# EAGLE design speaker_amp_single (EAGLE 6.3)

## Sheet 1 of 2
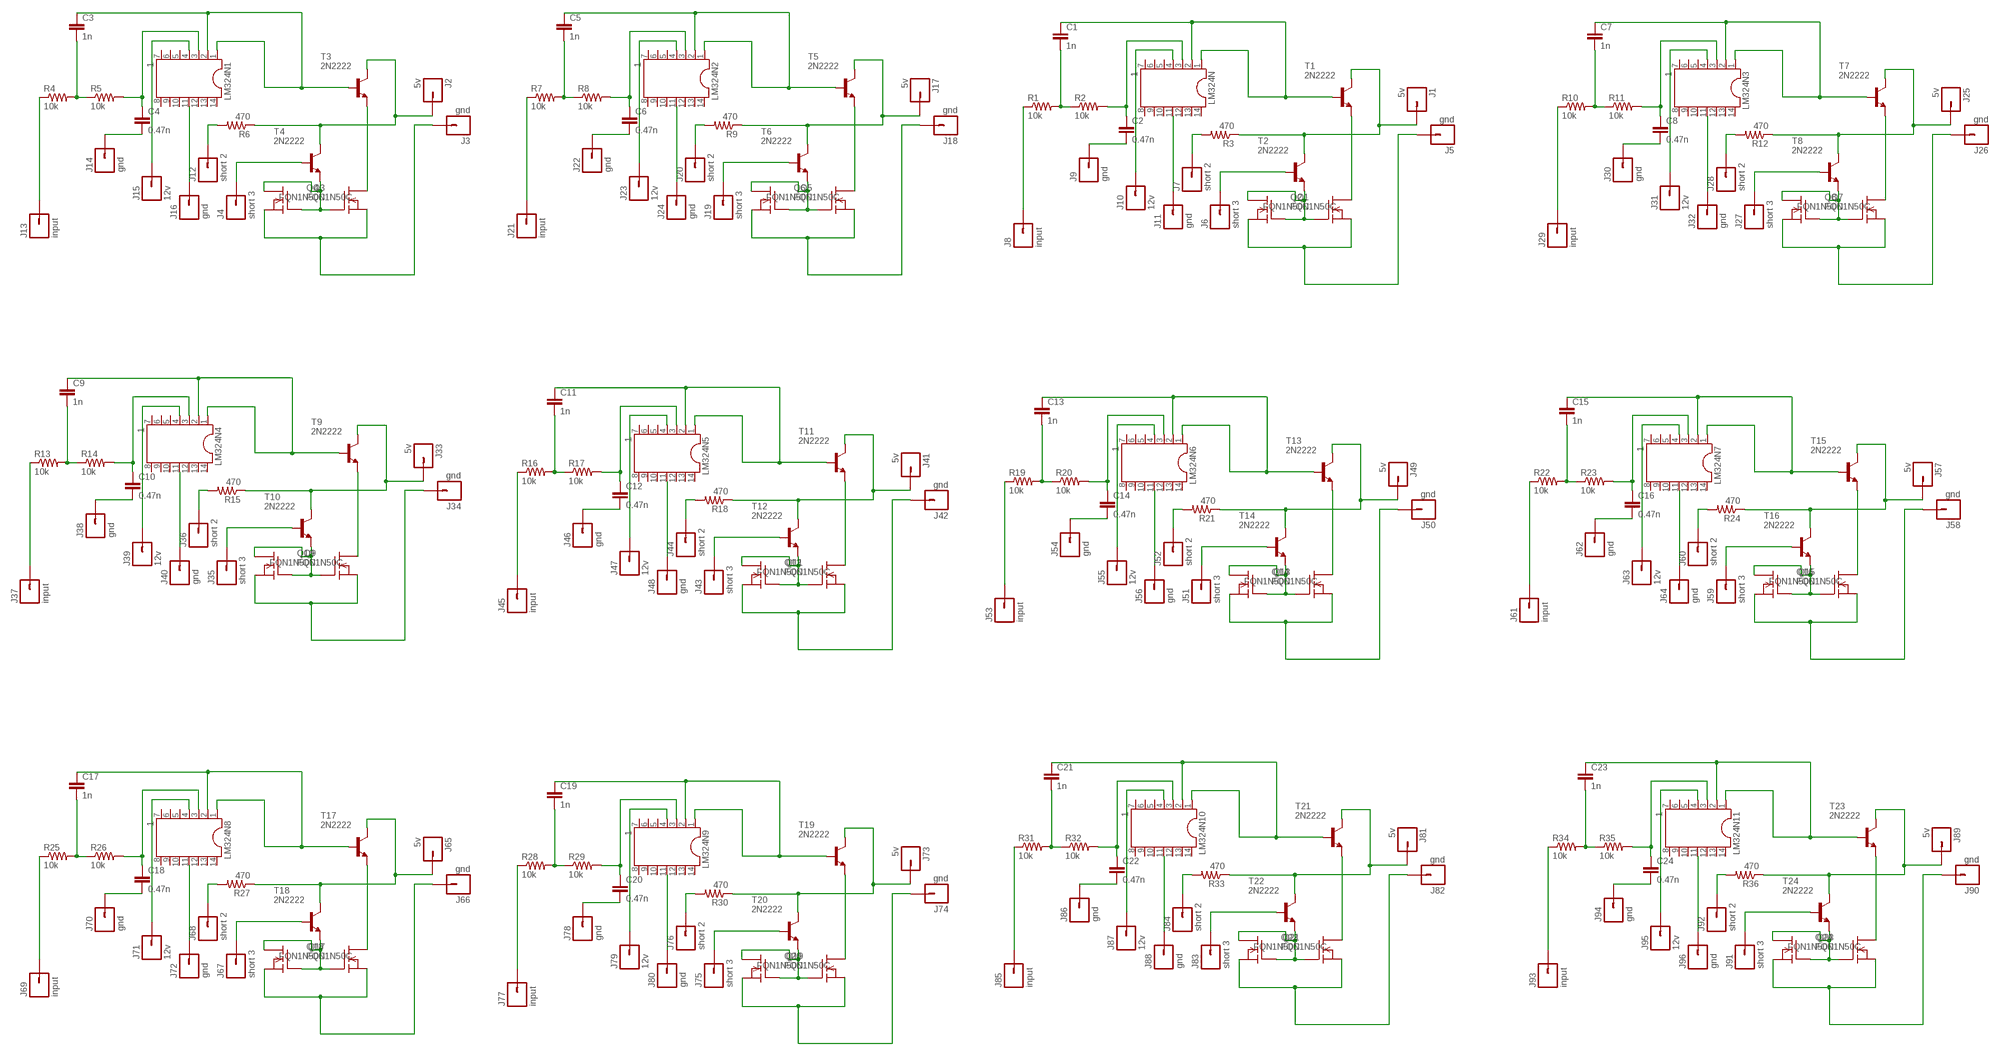
[diagram p0: schematic, sheet 1]

### Parts
C1  1n  CAPPTH  [CAP-PTH-SMALL]
C2  0.47n  CAPPTH  [CAP-PTH-SMALL]
C3  1n  CAPPTH  [CAP-PTH-SMALL]
C4  0.47n  CAPPTH  [CAP-PTH-SMALL]
C5  1n  CAPPTH  [CAP-PTH-SMALL]
C6  0.47n  CAPPTH  [CAP-PTH-SMALL]
C7  1n  CAPPTH  [CAP-PTH-SMALL]
C8  0.47n  CAPPTH  [CAP-PTH-SMALL]
C9  1n  CAPPTH  [CAP-PTH-SMALL]
C10  0.47n  CAPPTH  [CAP-PTH-SMALL]
C11  1n  CAPPTH  [CAP-PTH-SMALL]
C12  0.47n  CAPPTH  [CAP-PTH-SMALL]
C13  1n  CAPPTH  [CAP-PTH-SMALL]
C14  0.47n  CAPPTH  [CAP-PTH-SMALL]
C15  1n  CAPPTH  [CAP-PTH-SMALL]
C16  0.47n  CAPPTH  [CAP-PTH-SMALL]
C17  1n  CAPPTH  [CAP-PTH-SMALL]
C18  0.47n  CAPPTH  [CAP-PTH-SMALL]
C19  1n  CAPPTH  [CAP-PTH-SMALL]
C20  0.47n  CAPPTH  [CAP-PTH-SMALL]
C21  1n  CAPPTH  [CAP-PTH-SMALL]
C22  0.47n  CAPPTH  [CAP-PTH-SMALL]
C23  1n  CAPPTH  [CAP-PTH-SMALL]
C24  0.47n  CAPPTH  [CAP-PTH-SMALL]
J1  5v  M01PTH  [1X01]
J2  5v  M01PTH  [1X01]
J3  gnd  M01PTH  [1X01]
J4  short 3  M01PTH  [1X01]
J5  gnd  M01PTH  [1X01]
J6  short 3  M01PTH  [1X01]
J7  short 2  M01PTH  [1X01]
J8  input  M01PTH  [1X01]
J9  gnd  M01PTH  [1X01]
J10  12v  M01PTH  [1X01]
J11  gnd  M01PTH  [1X01]
J12  short 2  M01PTH  [1X01]
J13  input  M01PTH  [1X01]
J14  gnd  M01PTH  [1X01]
J15  12v  M01PTH  [1X01]
J16  gnd  M01PTH  [1X01]
J17  5v  M01PTH  [1X01]
J18  gnd  M01PTH  [1X01]
J19  short 3  M01PTH  [1X01]
J20  short 2  M01PTH  [1X01]
J21  input  M01PTH  [1X01]
J22  gnd  M01PTH  [1X01]
J23  12v  M01PTH  [1X01]
J24  gnd  M01PTH  [1X01]
J25  5v  M01PTH  [1X01]
J26  gnd  M01PTH  [1X01]
J27  short 3  M01PTH  [1X01]
J28  short 2  M01PTH  [1X01]
J29  input  M01PTH  [1X01]
J30  gnd  M01PTH  [1X01]
J31  12v  M01PTH  [1X01]
J32  gnd  M01PTH  [1X01]
J33  5v  M01PTH  [1X01]
J34  gnd  M01PTH  [1X01]
J35  short 3  M01PTH  [1X01]
J36  short 2  M01PTH  [1X01]
J37  input  M01PTH  [1X01]
J38  gnd  M01PTH  [1X01]
J39  12v  M01PTH  [1X01]
J40  gnd  M01PTH  [1X01]
J41  5v  M01PTH  [1X01]
J42  gnd  M01PTH  [1X01]
J43  short 3  M01PTH  [1X01]
J44  short 2  M01PTH  [1X01]
J45  input  M01PTH  [1X01]
J46  gnd  M01PTH  [1X01]
J47  12v  M01PTH  [1X01]
J48  gnd  M01PTH  [1X01]
J49  5v  M01PTH  [1X01]
J50  gnd  M01PTH  [1X01]
J51  short 3  M01PTH  [1X01]
J52  short 2  M01PTH  [1X01]
J53  input  M01PTH  [1X01]
J54  gnd  M01PTH  [1X01]
J55  12v  M01PTH  [1X01]
J56  gnd  M01PTH  [1X01]
J57  5v  M01PTH  [1X01]
J58  gnd  M01PTH  [1X01]
J59  short 3  M01PTH  [1X01]
J60  short 2  M01PTH  [1X01]
J61  input  M01PTH  [1X01]
J62  gnd  M01PTH  [1X01]
J63  12v  M01PTH  [1X01]
J64  gnd  M01PTH  [1X01]
J65  5v  M01PTH  [1X01]
J66  gnd  M01PTH  [1X01]
J67  short 3  M01PTH  [1X01]
J68  short 2  M01PTH  [1X01]
J69  input  M01PTH  [1X01]
J70  gnd  M01PTH  [1X01]
J71  12v  M01PTH  [1X01]
J72  gnd  M01PTH  [1X01]
J73  5v  M01PTH  [1X01]
J74  gnd  M01PTH  [1X01]
J75  short 3  M01PTH  [1X01]
J76  short 2  M01PTH  [1X01]
J77  input  M01PTH  [1X01]
J78  gnd  M01PTH  [1X01]
J79  12v  M01PTH  [1X01]
J80  gnd  M01PTH  [1X01]
J81  5v  M01PTH  [1X01]
J82  gnd  M01PTH  [1X01]
J83  short 3  M01PTH  [1X01]
J84  short 2  M01PTH  [1X01]
J85  input  M01PTH  [1X01]
J86  gnd  M01PTH  [1X01]
J87  12v  M01PTH  [1X01]
J88  gnd  M01PTH  [1X01]
J89  5v  M01PTH  [1X01]
J90  gnd  M01PTH  [1X01]
J91  short 3  M01PTH  [1X01]
J92  short 2  M01PTH  [1X01]
J93  input  M01PTH  [1X01]
J94  gnd  M01PTH  [1X01]
J95  12v  M01PTH  [1X01]
J96  gnd  M01PTH  [1X01]
LM324N  1  DIL14  [DIL14]
LM324N1  1  DIL14  [DIL14]
LM324N2  1  DIL14  [DIL14]
LM324N3  1  DIL14  [DIL14]
LM324N4  1  DIL14  [DIL14]
LM324N5  1  DIL14  [DIL14]
LM324N6  1  DIL14  [DIL14]
LM324N7  1  DIL14  [DIL14]
LM324N8  1  DIL14  [DIL14]
LM324N9  1  DIL14  [DIL14]
LM324N10  1  DIL14  [DIL14]
LM324N11  1  DIL14  [DIL14]
Q1  FQN1N50C  [TO92]
Q2  FQN1N50C  [TO92]
Q3  FQN1N50C  [TO92]
Q4  FQN1N50C  [TO92]
Q5  FQN1N50C  [TO92]
Q6  FQN1N50C  [TO92]
Q7  FQN1N50C  [TO92]
Q8  FQN1N50C  [TO92]
Q9  FQN1N50C  [TO92]
Q10  FQN1N50C  [TO92]
Q11  FQN1N50C  [TO92]
Q12  FQN1N50C  [TO92]
Q13  FQN1N50C  [TO92]
Q14  FQN1N50C  [TO92]
Q15  FQN1N50C  [TO92]
Q16  FQN1N50C  [TO92]
Q17  FQN1N50C  [TO92]
Q18  FQN1N50C  [TO92]
Q19  FQN1N50C  [TO92]
Q20  FQN1N50C  [TO92]
Q21  FQN1N50C  [TO92]
Q22  FQN1N50C  [TO92]
Q23  FQN1N50C  [TO92]
Q24  FQN1N50C  [TO92]
R1  10k  RESISTORAXIAL-0.3  [AXIAL-0.3]
R2  10k  RESISTORAXIAL-0.3  [AXIAL-0.3]
R3  470  RESISTORAXIAL-0.3  [AXIAL-0.3]
R4  10k  RESISTORAXIAL-0.3  [AXIAL-0.3]
R5  10k  RESISTORAXIAL-0.3  [AXIAL-0.3]
R6  470  RESISTORAXIAL-0.3  [AXIAL-0.3]
R7  10k  RESISTORAXIAL-0.3  [AXIAL-0.3]
R8  10k  RESISTORAXIAL-0.3  [AXIAL-0.3]
R9  470  RESISTORAXIAL-0.3  [AXIAL-0.3]
R10  10k  RESISTORAXIAL-0.3  [AXIAL-0.3]
R11  10k  RESISTORAXIAL-0.3  [AXIAL-0.3]
R12  470  RESISTORAXIAL-0.3  [AXIAL-0.3]
R13  10k  RESISTORAXIAL-0.3  [AXIAL-0.3]
R14  10k  RESISTORAXIAL-0.3  [AXIAL-0.3]
R15  470  RESISTORAXIAL-0.3  [AXIAL-0.3]
R16  10k  RESISTORAXIAL-0.3  [AXIAL-0.3]
R17  10k  RESISTORAXIAL-0.3  [AXIAL-0.3]
R18  470  RESISTORAXIAL-0.3  [AXIAL-0.3]
R19  10k  RESISTORAXIAL-0.3  [AXIAL-0.3]
R20  10k  RESISTORAXIAL-0.3  [AXIAL-0.3]
R21  470  RESISTORAXIAL-0.3  [AXIAL-0.3]
R22  10k  RESISTORAXIAL-0.3  [AXIAL-0.3]
R23  10k  RESISTORAXIAL-0.3  [AXIAL-0.3]
R24  470  RESISTORAXIAL-0.3  [AXIAL-0.3]
R25  10k  RESISTORAXIAL-0.3  [AXIAL-0.3]
R26  10k  RESISTORAXIAL-0.3  [AXIAL-0.3]
R27  470  RESISTORAXIAL-0.3  [AXIAL-0.3]
R28  10k  RESISTORAXIAL-0.3  [AXIAL-0.3]
R29  10k  RESISTORAXIAL-0.3  [AXIAL-0.3]
R30  470  RESISTORAXIAL-0.3  [AXIAL-0.3]
R31  10k  RESISTORAXIAL-0.3  [AXIAL-0.3]
R32  10k  RESISTORAXIAL-0.3  [AXIAL-0.3]
R33  470  RESISTORAXIAL-0.3  [AXIAL-0.3]
R34  10k  RESISTORAXIAL-0.3  [AXIAL-0.3]
R35  10k  RESISTORAXIAL-0.3  [AXIAL-0.3]
R36  470  RESISTORAXIAL-0.3  [AXIAL-0.3]
T1  2N2222  [TO92-EBC-OVAL]
T2  2N2222  [TO92-EBC-OVAL]
T3  2N2222  [TO92-EBC-OVAL]
T4  2N2222  [TO92-EBC-OVAL]
T5  2N2222  [TO92-EBC-OVAL]
T6  2N2222  [TO92-EBC-OVAL]
T7  2N2222  [TO92-EBC-OVAL]
T8  2N2222  [TO92-EBC-OVAL]
T9  2N2222  [TO92-EBC-OVAL]
T10  2N2222  [TO92-EBC-OVAL]
T11  2N2222  [TO92-EBC-OVAL]
T12  2N2222  [TO92-EBC-OVAL]
T13  2N2222  [TO92-EBC-OVAL]
T14  2N2222  [TO92-EBC-OVAL]
T15  2N2222  [TO92-EBC-OVAL]
T16  2N2222  [TO92-EBC-OVAL]
T17  2N2222  [TO92-EBC-OVAL]
T18  2N2222  [TO92-EBC-OVAL]
T19  2N2222  [TO92-EBC-OVAL]
T20  2N2222  [TO92-EBC-OVAL]
T21  2N2222  [TO92-EBC-OVAL]
T22  2N2222  [TO92-EBC-OVAL]
T23  2N2222  [TO92-EBC-OVAL]
T24  2N2222  [TO92-EBC-OVAL]

### Nets
N$1: C1.2 R1.P$2 R2.P$1
N$2: C2.1 LM324N.3 R2.P$2
N$3: C1.1 LM324N.1 LM324N.2 T1.B
N$4: Q2.2(D) T1.E
N$5: Q1.1(G) Q1.2(D) Q2.1(G) T2.E
N$6: J7.1 R3.P$2
N$7: J11.1 LM324N.11
N$8: J6.1 T2.B
N$9: J8.1 R1.P$1
N$10: J1.1 R3.P$1 T1.C T2.C
N$11: C2.2 J9.1
N$12: J5.1 Q1.3(S) Q2.3(S)
N$13: C3.2 R4.P$2 R5.P$1
N$14: J10.1 LM324N.4
N$15: C4.1 LM324N1.3 R5.P$2
N$16: C3.1 LM324N1.1 LM324N1.2 T3.B
N$17: Q4.2(D) T3.E
N$18: Q3.1(G) Q3.2(D) Q4.1(G) T4.E
N$19: J2.1 R6.P$1 T3.C T4.C
N$20: J3.1 Q3.3(S) Q4.3(S)
N$21: J16.1 LM324N1.11
N$22: J4.1 T4.B
N$23: J13.1 R4.P$1
N$24: C4.2 J14.1
N$25: J15.1 LM324N1.4
N$26: J12.1 R6.P$2
N$27: C5.2 R7.P$2 R8.P$1
N$28: C6.1 LM324N2.3 R8.P$2
N$29: C5.1 LM324N2.1 LM324N2.2 T5.B
N$30: Q6.2(D) T5.E
N$31: Q5.1(G) Q5.2(D) Q6.1(G) T6.E
N$32: J17.1 R9.P$1 T5.C T6.C
N$33: J18.1 Q5.3(S) Q6.3(S)
N$34: J24.1 LM324N2.11
N$35: J19.1 T6.B
N$36: J21.1 R7.P$1
N$37: C6.2 J22.1
N$38: J23.1 LM324N2.4
N$39: J20.1 R9.P$2
N$40: C7.2 R10.P$2 R11.P$1
N$41: C8.1 LM324N3.3 R11.P$2
N$42: C7.1 LM324N3.1 LM324N3.2 T7.B
N$43: Q8.2(D) T7.E
N$44: Q7.1(G) Q7.2(D) Q8.1(G) T8.E
N$45: J25.1 R12.P$1 T7.C T8.C
N$46: J26.1 Q7.3(S) Q8.3(S)
N$47: J32.1 LM324N3.11
N$48: J27.1 T8.B
N$49: J29.1 R10.P$1
N$50: C8.2 J30.1
N$51: J31.1 LM324N3.4
N$52: J28.1 R12.P$2
N$53: C9.2 R13.P$2 R14.P$1
N$54: C10.1 LM324N4.3 R14.P$2
N$55: C9.1 LM324N4.1 LM324N4.2 T9.B
N$56: Q10.2(D) T9.E
N$57: Q9.1(G) Q9.2(D) Q10.1(G) T10.E
N$58: J33.1 R15.P$1 T9.C T10.C
N$59: J34.1 Q9.3(S) Q10.3(S)
N$60: J40.1 LM324N4.11
N$61: J35.1 T10.B
N$62: J37.1 R13.P$1
N$63: C10.2 J38.1
N$64: J39.1 LM324N4.4
N$65: J36.1 R15.P$2
N$66: C11.2 R16.P$2 R17.P$1
N$67: C12.1 LM324N5.3 R17.P$2
N$68: C11.1 LM324N5.1 LM324N5.2 T11.B
N$69: Q12.2(D) T11.E
N$70: Q11.1(G) Q11.2(D) Q12.1(G) T12.E
N$71: J41.1 R18.P$1 T11.C T12.C
N$72: J42.1 Q11.3(S) Q12.3(S)
N$73: J48.1 LM324N5.11
N$74: J43.1 T12.B
N$75: J45.1 R16.P$1
N$76: C12.2 J46.1
N$77: J47.1 LM324N5.4
N$78: J44.1 R18.P$2
N$79: C13.2 R19.P$2 R20.P$1
N$80: C14.1 LM324N6.3 R20.P$2
N$81: C13.1 LM324N6.1 LM324N6.2 T13.B
N$82: Q14.2(D) T13.E
N$83: Q13.1(G) Q13.2(D) Q14.1(G) T14.E
N$84: J49.1 R21.P$1 T13.C T14.C
N$85: J50.1 Q13.3(S) Q14.3(S)
N$86: J56.1 LM324N6.11
N$87: J51.1 T14.B
N$88: J53.1 R19.P$1
N$89: C14.2 J54.1
N$90: J55.1 LM324N6.4
N$91: J52.1 R21.P$2
N$92: C15.2 R22.P$2 R23.P$1
N$93: C16.1 LM324N7.3 R23.P$2
N$94: C15.1 LM324N7.1 LM324N7.2 T15.B
N$95: Q16.2(D) T15.E
N$96: Q15.1(G) Q15.2(D) Q16.1(G) T16.E
N$97: J57.1 R24.P$1 T15.C T16.C
N$98: J58.1 Q15.3(S) Q16.3(S)
N$99: J64.1 LM324N7.11
N$100: J59.1 T16.B
N$101: J61.1 R22.P$1
N$102: C16.2 J62.1
N$103: J63.1 LM324N7.4
N$104: J60.1 R24.P$2
N$105: C17.2 R25.P$2 R26.P$1
N$106: C18.1 LM324N8.3 R26.P$2
N$107: C17.1 LM324N8.1 LM324N8.2 T17.B
N$108: Q18.2(D) T17.E
N$109: Q17.1(G) Q17.2(D) Q18.1(G) T18.E
N$110: J65.1 R27.P$1 T17.C T18.C
N$111: J66.1 Q17.3(S) Q18.3(S)
N$112: J72.1 LM324N8.11
N$113: J67.1 T18.B
N$114: J69.1 R25.P$1
N$115: C18.2 J70.1
N$116: J71.1 LM324N8.4
N$117: J68.1 R27.P$2
N$118: C19.2 R28.P$2 R29.P$1
N$119: C20.1 LM324N9.3 R29.P$2
N$120: C19.1 LM324N9.1 LM324N9.2 T19.B
N$121: Q20.2(D) T19.E
N$122: Q19.1(G) Q19.2(D) Q20.1(G) T20.E
N$123: J73.1 R30.P$1 T19.C T20.C
N$124: J74.1 Q19.3(S) Q20.3(S)
N$125: J80.1 LM324N9.11
N$126: J75.1 T20.B
N$127: J77.1 R28.P$1
N$128: C20.2 J78.1
N$129: J79.1 LM324N9.4
N$130: J76.1 R30.P$2
N$131: C21.2 R31.P$2 R32.P$1
N$132: C22.1 LM324N10.3 R32.P$2
N$133: C21.1 LM324N10.1 LM324N10.2 T21.B
N$134: Q22.2(D) T21.E
N$135: Q21.1(G) Q21.2(D) Q22.1(G) T22.E
N$136: J81.1 R33.P$1 T21.C T22.C
N$137: J82.1 Q21.3(S) Q22.3(S)
N$138: J88.1 LM324N10.11
N$139: J83.1 T22.B
N$140: J85.1 R31.P$1
N$141: C22.2 J86.1
N$142: J87.1 LM324N10.4
N$143: J84.1 R33.P$2
N$144: C23.2 R34.P$2 R35.P$1
N$145: C24.1 LM324N11.3 R35.P$2
N$146: C23.1 LM324N11.1 LM324N11.2 T23.B
N$147: Q24.2(D) T23.E
N$148: Q23.1(G) Q23.2(D) Q24.1(G) T24.E
N$149: J89.1 R36.P$1 T23.C T24.C
N$150: J90.1 Q23.3(S) Q24.3(S)
N$151: J96.1 LM324N11.11
N$152: J91.1 T24.B
N$153: J93.1 R34.P$1
N$154: C24.2 J94.1
N$155: J95.1 LM324N11.4
N$156: J92.1 R36.P$2
Unconnected: LM324N1.5 LM324N1.6 LM324N1.7 LM324N1.8 LM324N1.9 LM324N1.10 LM324N1.12 LM324N1.13 LM324N1.14 LM324N2.5 LM324N2.6 LM324N2.7 LM324N2.8 LM324N2.9 LM324N2.10 LM324N2.12 LM324N2.13 LM324N2.14 LM324N3.5 LM324N3.6 LM324N3.7 LM324N3.8 LM324N3.9 LM324N3.10 LM324N3.12 LM324N3.13 LM324N3.14 LM324N4.5 LM324N4.6 LM324N4.7 LM324N4.8 LM324N4.9 LM324N4.10 LM324N4.12 LM324N4.13 LM324N4.14 LM324N5.5 LM324N5.6 LM324N5.7 LM324N5.8 LM324N5.9 LM324N5.10 LM324N5.12 LM324N5.13 LM324N5.14 LM324N6.5 LM324N6.6 LM324N6.7 LM324N6.8 LM324N6.9 LM324N6.10 LM324N6.12 LM324N6.13 LM324N6.14 LM324N7.5 LM324N7.6 LM324N7.7 LM324N7.8 LM324N7.9 LM324N7.10 LM324N7.12 LM324N7.13 LM324N7.14 LM324N8.5 LM324N8.6 LM324N8.7 LM324N8.8 LM324N8.9 LM324N8.10 LM324N8.12 LM324N8.13 LM324N8.14 LM324N9.5 LM324N9.6 LM324N9.7 LM324N9.8 LM324N9.9 LM324N9.10 LM324N9.12 LM324N9.13 LM324N9.14 LM324N10.5 LM324N10.6 LM324N10.7 LM324N10.8 LM324N10.9 LM324N10.10 LM324N10.12 LM324N10.13 LM324N10.14 LM324N11.5 LM324N11.6 LM324N11.7 LM324N11.8 LM324N11.9 LM324N11.10 LM324N11.12 LM324N11.13 LM324N11.14 LM324N.5 LM324N.6 LM324N.7 LM324N.8 LM324N.9 LM324N.10 LM324N.12 LM324N.13 LM324N.14

## Sheet 2 of 2

## Library data of the parts
C1-C24 = SparkFun-Passives:CAP: Capacitor Standard 0603 ceramic capacitor, and 0.1" leaded capacitor.
J1-J96 = SparkFun-Connectors:M01: Header 1 Standard 1-pin 0.1" header. Use with straight break away headers (SKU : PRT-00116), right angle break away headers (PRT-00553), swiss pins (PRT-00743), machine pins (PRT-00117), and female headers (PRT-00115). SMTSO-256-ET is a "flush mount" nut for a 4-40 screw. The older package used to be too tight, and did not allow it to sit properly thru the drill hit. The latest (0.165DIA) fits nice and snug.
LM324N LM324N1-LM324N11 = ic-package:DIL14: Dual In Line / Socket
Q1-Q24 = adafruit:FQN1N50C: N-Channel Enhancement MOSFET 500V, 0.4A, 6.0 Ohm
R1-R36 = SparkFun-Resistors:RESISTOR: Resistor Basic schematic elements and footprints for 0603, 1206, and PTH resistors.
T1-T24 = adafruit:2N2222: NPN TRANSISTOR Big oval pads

## Board
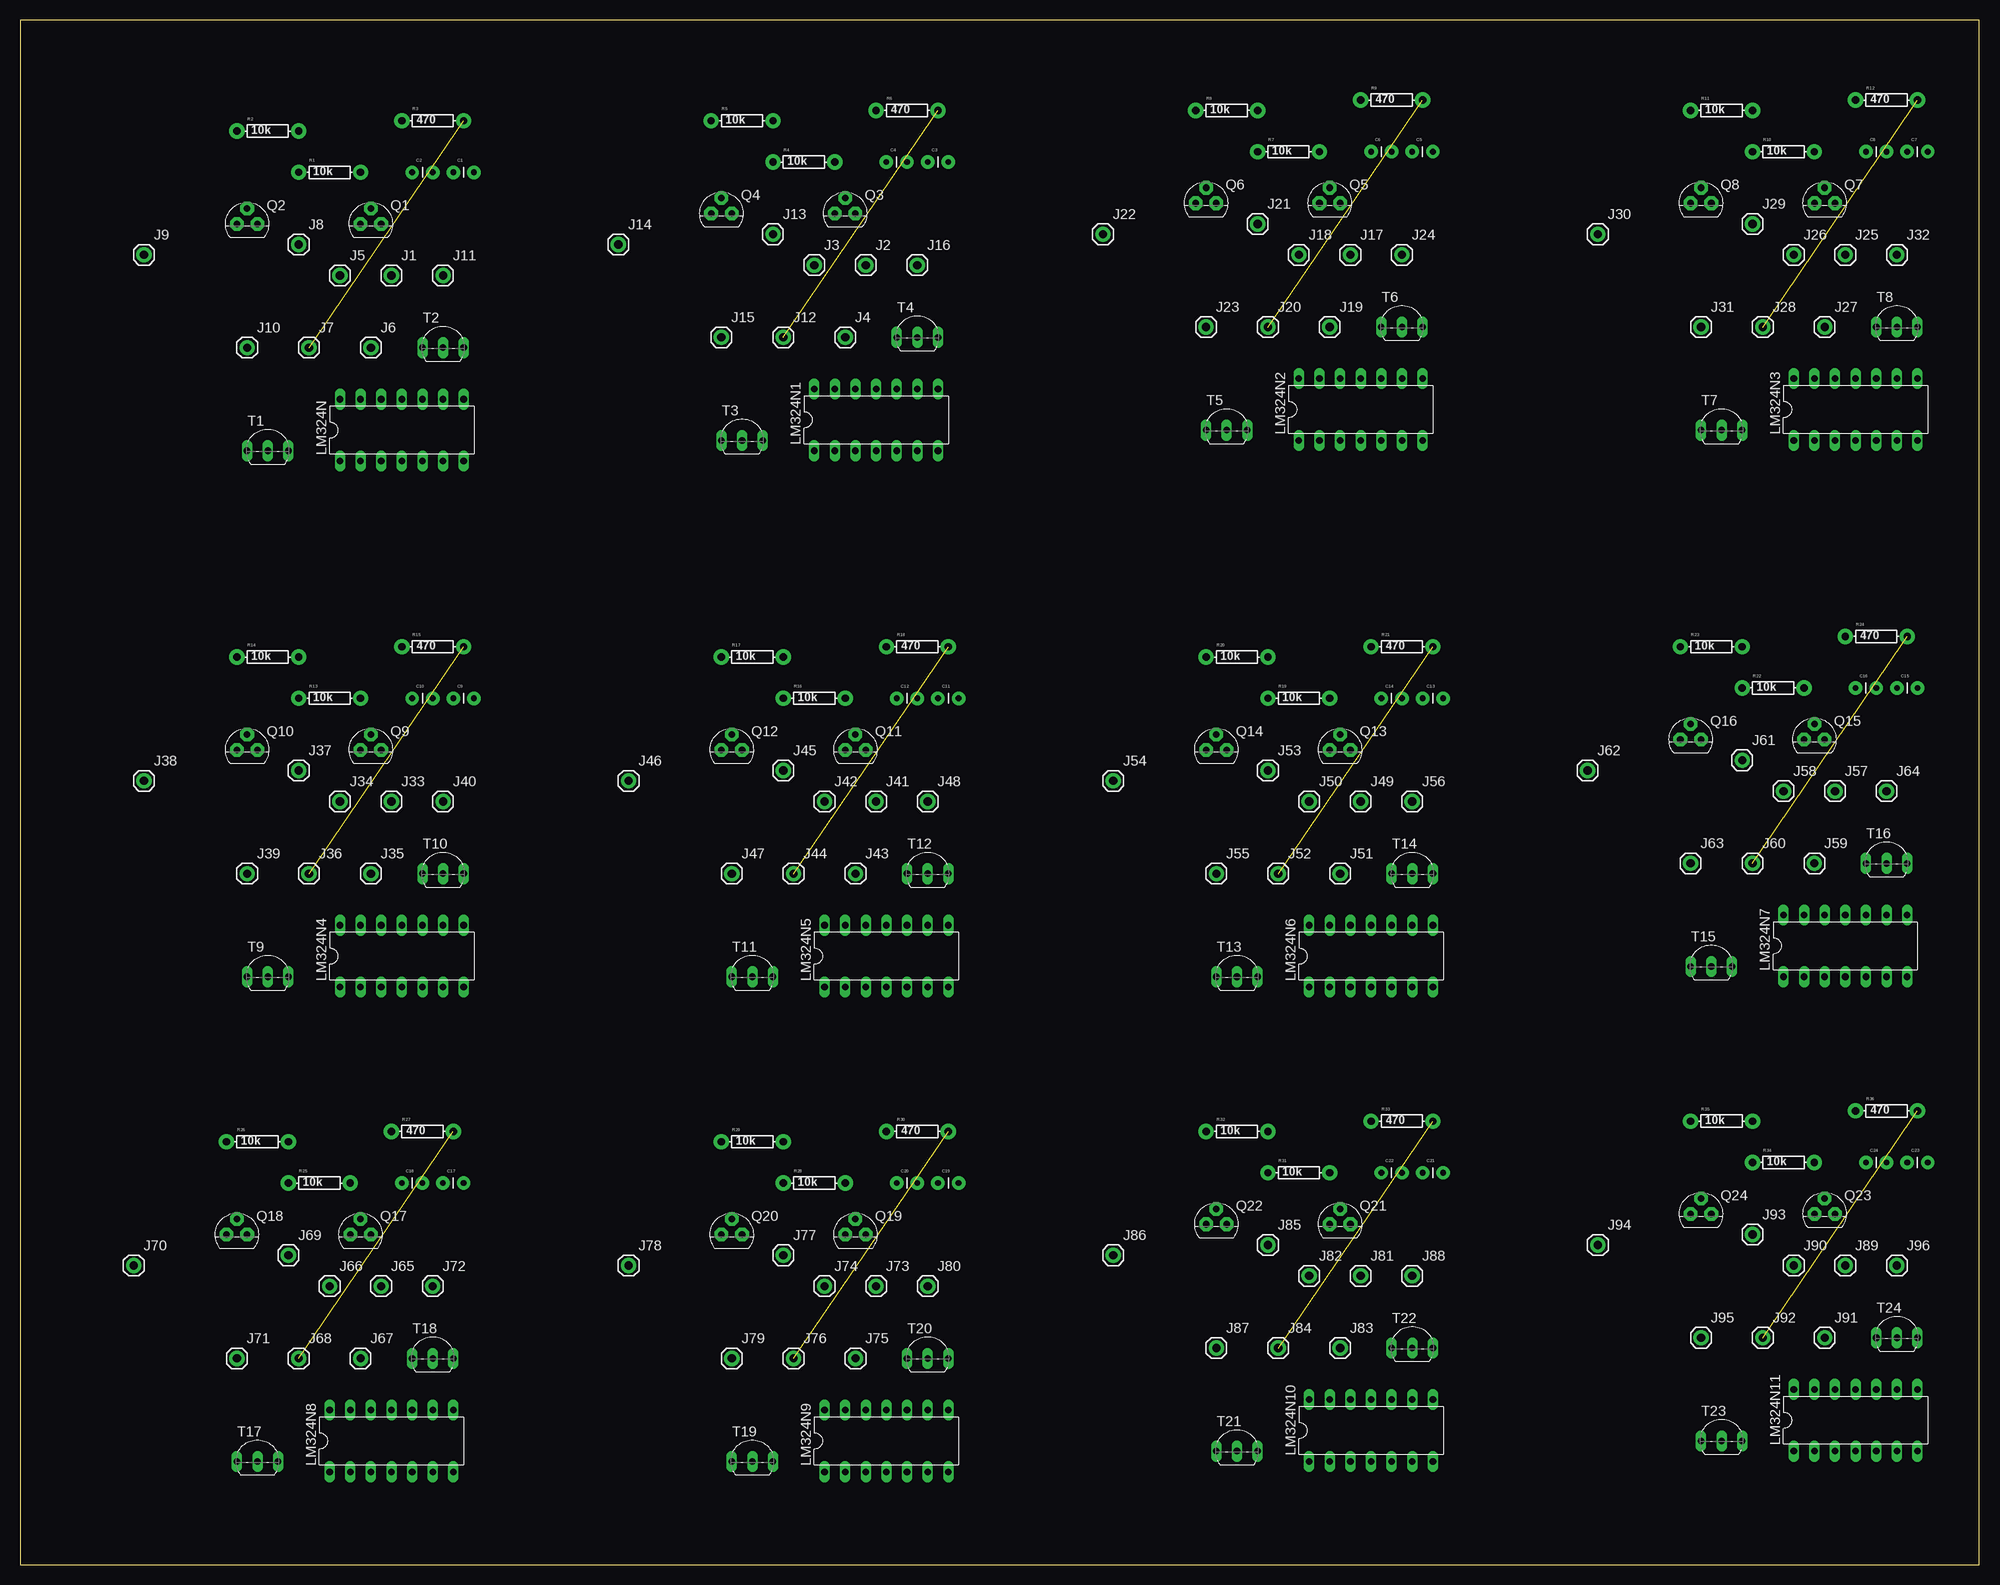
[diagram p1: board, top side]
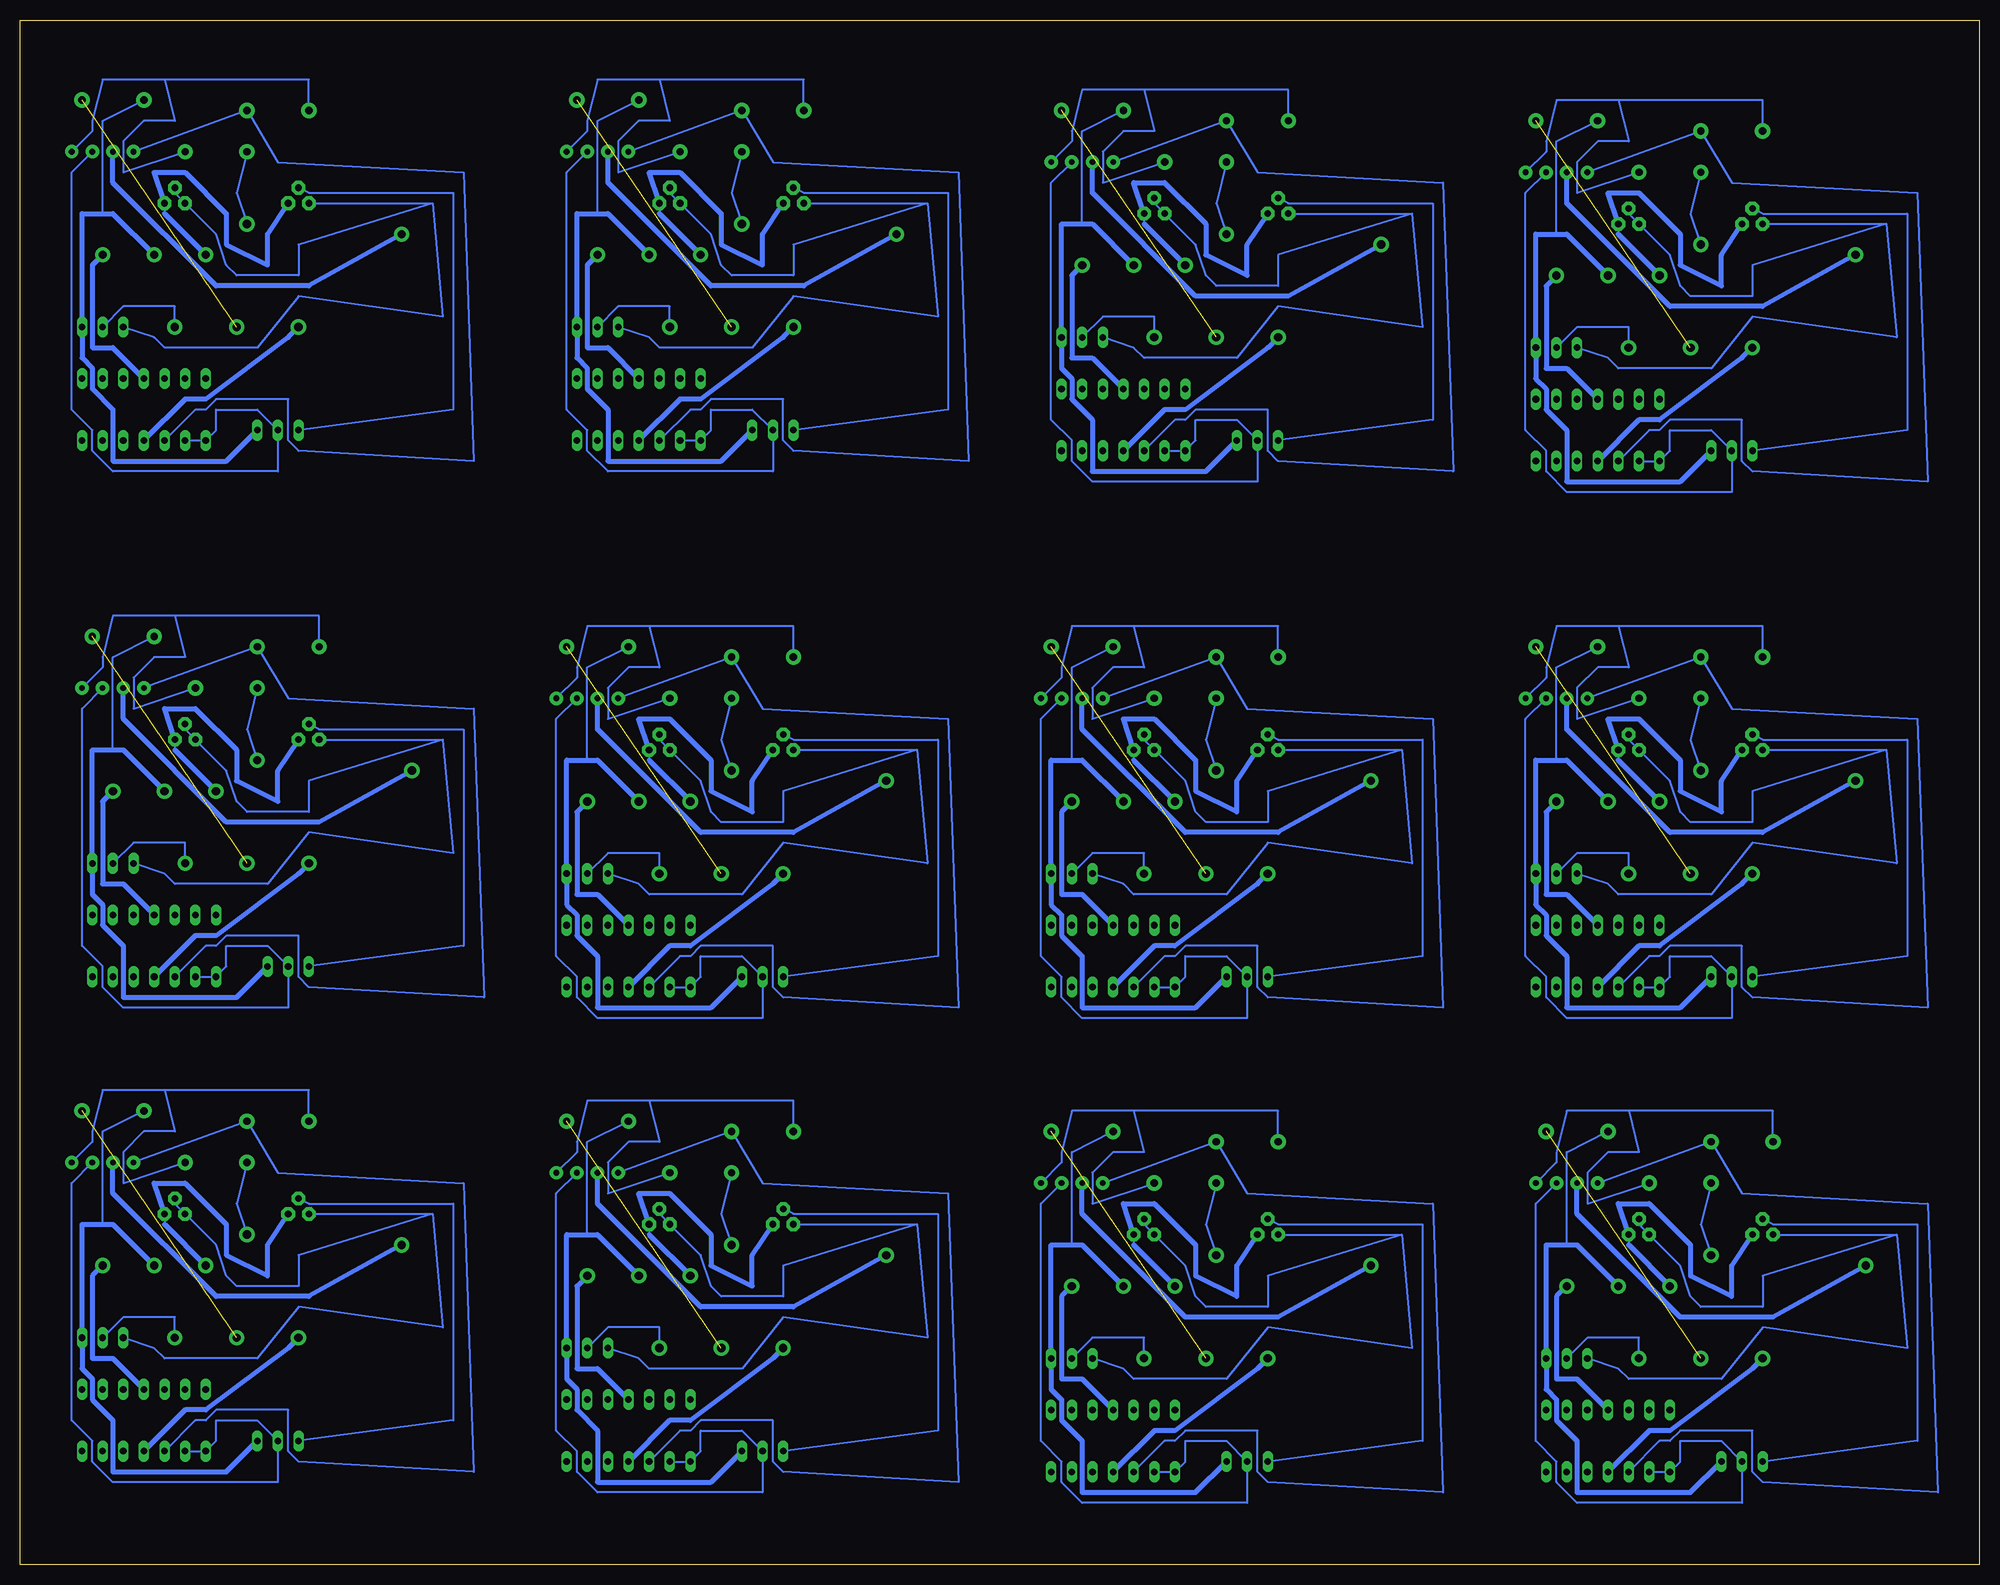
[diagram p2: board, bottom side, seen from below]

Size 241.28 x 190.17 mm. Coordinates in mm from the lower left corner, seen from the top.
Outline: 0,0 241.28,0 241.28,190.17 0,190.17 0,0
Copper layers (1*16): Top 0.035mm / dielectric 1.5mm / Bottom 0.035mm
Design rules "default *": minimum track width 10mil, minimum drill 24mil, track to track 12mil, track to pad 12mil, pad to pad 12mil, via to via 12mil, smd to smd 12mil, copper to edge 40mil, drill to drill 8mil, minimum pad ring 10mil, minimum via ring 8mil, stop-mask expansion 4mil, vias tented up to drill 0mil, thermal gap 10mil

### Footprints (pad centres in the part's own frame; a part is rotated, then mirrored left to right if it is on the bottom)
CAP-PTH-SMALL = drill 0.7 pad 1.651: 1 0,0; 2 2.54,0
1X01 = drill 1.016 pad 1.88: 1 0,0
DIL14 = drill 0.813 long: 1 -7.62,-3.81; 2 -5.08,-3.81; 3 -2.54,-3.81; 4 0,-3.81; 5 2.54,-3.81; 6 5.08,-3.81; 7 7.62,-3.81; 8 7.62,3.81; 9 5.08,3.81; 10 2.54,3.81; 11 0,3.81; 12 -2.54,3.81; 13 -5.08,3.81; 14 -7.62,3.81
TO92 = drill 0.813 pad 1.676 octagon: 1 -1.27,0; 2 0,1.905; 3 1.27,0
AXIAL-0.3 = drill 0.9 pad 1.88: P$1 -3.81,0; P$2 3.81,0
TO92-EBC-OVAL = drill 0.813 long: B 0,-1.27; C 2.54,-1.27; E -2.54,-1.27

### Placement (x,y rotation side)
C1  53.34,171.45 0 top
C2  48.26,171.45 0 top
C3  111.76,172.72 0 top
C4  106.68,172.72 0 top
C5  171.45,173.99 0 top
C6  166.37,173.99 0 top
C7  232.41,173.99 0 top
C8  227.33,173.99 0 top
C9  53.34,106.68 0 top
C10  48.26,106.68 0 top
C11  113.03,106.68 0 top
C12  107.95,106.68 0 top
C13  172.72,106.68 0 top
C14  167.64,106.68 0 top
C15  231.14,107.95 0 top
C16  226.06,107.95 0 top
C17  52.07,46.99 0 top
C18  46.99,46.99 0 top
C19  113.03,46.99 0 top
C20  107.95,46.99 0 top
C21  172.72,48.26 0 top
C22  167.64,48.26 0 top
C23  232.41,49.53 0 top
C24  227.33,49.53 0 top
J1  45.72,158.75 0 top
J2  104.14,160.02 0 top
J3  97.79,160.02 0 top
J4  101.6,151.13 0 top
J5  39.37,158.75 0 top
J6  43.18,149.86 0 top
J7  35.56,149.86 0 top
J8  34.29,162.56 0 top
J9  15.24,161.29 0 top
J10  27.94,149.86 0 top
J11  52.07,158.75 0 top
J12  93.98,151.13 0 top
J13  92.71,163.83 0 top
J14  73.66,162.56 0 top
J15  86.36,151.13 0 top
J16  110.49,160.02 0 top
J17  163.83,161.29 0 top
J18  157.48,161.29 0 top
J19  161.29,152.4 0 top
J20  153.67,152.4 0 top
J21  152.4,165.1 0 top
J22  133.35,163.83 0 top
J23  146.05,152.4 0 top
J24  170.18,161.29 0 top
J25  224.79,161.29 0 top
J26  218.44,161.29 0 top
J27  222.25,152.4 0 top
J28  214.63,152.4 0 top
J29  213.36,165.1 0 top
J30  194.31,163.83 0 top
J31  207.01,152.4 0 top
J32  231.14,161.29 0 top
J33  45.72,93.98 0 top
J34  39.37,93.98 0 top
J35  43.18,85.09 0 top
J36  35.56,85.09 0 top
J37  34.29,97.79 0 top
J38  15.24,96.52 0 top
J39  27.94,85.09 0 top
J40  52.07,93.98 0 top
J41  105.41,93.98 0 top
J42  99.06,93.98 0 top
J43  102.87,85.09 0 top
J44  95.25,85.09 0 top
J45  93.98,97.79 0 top
J46  74.93,96.52 0 top
J47  87.63,85.09 0 top
J48  111.76,93.98 0 top
J49  165.1,93.98 0 top
J50  158.75,93.98 0 top
J51  162.56,85.09 0 top
J52  154.94,85.09 0 top
J53  153.67,97.79 0 top
J54  134.62,96.52 0 top
J55  147.32,85.09 0 top
J56  171.45,93.98 0 top
J57  223.52,95.25 0 top
J58  217.17,95.25 0 top
J59  220.98,86.36 0 top
J60  213.36,86.36 0 top
J61  212.09,99.06 0 top
J62  193.04,97.79 0 top
J63  205.74,86.36 0 top
J64  229.87,95.25 0 top
J65  44.45,34.29 0 top
J66  38.1,34.29 0 top
J67  41.91,25.4 0 top
J68  34.29,25.4 0 top
J69  33.02,38.1 0 top
J70  13.97,36.83 0 top
J71  26.67,25.4 0 top
J72  50.8,34.29 0 top
J73  105.41,34.29 0 top
J74  99.06,34.29 0 top
J75  102.87,25.4 0 top
J76  95.25,25.4 0 top
J77  93.98,38.1 0 top
J78  74.93,36.83 0 top
J79  87.63,25.4 0 top
J80  111.76,34.29 0 top
J81  165.1,35.56 0 top
J82  158.75,35.56 0 top
J83  162.56,26.67 0 top
J84  154.94,26.67 0 top
J85  153.67,39.37 0 top
J86  134.62,38.1 0 top
J87  147.32,26.67 0 top
J88  171.45,35.56 0 top
J89  224.79,36.83 0 top
J90  218.44,36.83 0 top
J91  222.25,27.94 0 top
J92  214.63,27.94 0 top
J93  213.36,40.64 0 top
J94  194.31,39.37 0 top
J95  207.01,27.94 0 top
J96  231.14,36.83 0 top
LM324N  46.99,139.7 0 top
LM324N1  105.41,140.97 0 top
LM324N2  165.1,142.24 0 top
LM324N3  226.06,142.24 0 top
LM324N4  46.99,74.93 0 top
LM324N5  106.68,74.93 0 top
LM324N6  166.37,74.93 0 top
LM324N7  224.79,76.2 0 top
LM324N8  45.72,15.24 0 top
LM324N9  106.68,15.24 0 top
LM324N10  166.37,16.51 0 top
LM324N11  226.06,17.78 0 top
Q1  43.18,165.1 0 top
Q2  27.94,165.1 0 top
Q3  101.6,166.37 0 top
Q4  86.36,166.37 0 top
Q5  161.29,167.64 0 top
Q6  146.05,167.64 0 top
Q7  222.25,167.64 0 top
Q8  207.01,167.64 0 top
Q9  43.18,100.33 0 top
Q10  27.94,100.33 0 top
Q11  102.87,100.33 0 top
Q12  87.63,100.33 0 top
Q13  162.56,100.33 0 top
Q14  147.32,100.33 0 top
Q15  220.98,101.6 0 top
Q16  205.74,101.6 0 top
Q17  41.91,40.64 0 top
Q18  26.67,40.64 0 top
Q19  102.87,40.64 0 top
Q20  87.63,40.64 0 top
Q21  162.56,41.91 0 top
Q22  147.32,41.91 0 top
Q23  222.25,43.18 0 top
Q24  207.01,43.18 0 top
R1  38.1,171.45 0 top
R2  30.48,176.53 0 top
R3  50.8,177.8 0 top
R4  96.52,172.72 0 top
R5  88.9,177.8 0 top
R6  109.22,179.07 0 top
R7  156.21,173.99 0 top
R8  148.59,179.07 0 top
R9  168.91,180.34 0 top
R10  217.17,173.99 0 top
R11  209.55,179.07 0 top
R12  229.87,180.34 0 top
R13  38.1,106.68 0 top
R14  30.48,111.76 0 top
R15  50.8,113.03 0 top
R16  97.79,106.68 0 top
R17  90.17,111.76 0 top
R18  110.49,113.03 0 top
R19  157.48,106.68 0 top
R20  149.86,111.76 0 top
R21  170.18,113.03 0 top
R22  215.9,107.95 0 top
R23  208.28,113.03 0 top
R24  228.6,114.3 0 top
R25  36.83,46.99 0 top
R26  29.21,52.07 0 top
R27  49.53,53.34 0 top
R28  97.79,46.99 0 top
R29  90.17,52.07 0 top
R30  110.49,53.34 0 top
R31  157.48,48.26 0 top
R32  149.86,53.34 0 top
R33  170.18,54.61 0 top
R34  217.17,49.53 0 top
R35  209.55,54.61 0 top
R36  229.87,55.88 0 top
T1  30.48,138.43 0 top
T2  52.07,151.13 0 top
T3  88.9,139.7 0 top
T4  110.49,152.4 0 top
T5  148.59,140.97 0 top
T6  170.18,153.67 0 top
T7  209.55,140.97 0 top
T8  231.14,153.67 0 top
T9  30.48,73.66 0 top
T10  52.07,86.36 0 top
T11  90.17,73.66 0 top
T12  111.76,86.36 0 top
T13  149.86,73.66 0 top
T14  171.45,86.36 0 top
T15  208.28,74.93 0 top
T16  229.87,87.63 0 top
T17  29.21,13.97 0 top
T18  50.8,26.67 0 top
T19  90.17,13.97 0 top
T20  111.76,26.67 0 top
T21  149.86,15.24 0 top
T22  171.45,27.94 0 top
T23  209.55,16.51 0 top
T24  231.14,29.21 0 top

### Tracks (layer width: path | path; a pad name or v marks a point on that pad's centre or on a via)
N$1
  Bottom 0.254: C1.2 53.34,173.99 53.34,175.26 52.07,180.34 44.45,180.34 | 44.45,180.34 26.67,180.34 R2.P$1 | R1.P$2 49.53,168.91 49.53,172.72 46.99,175.26 43.18,175.26 44.45,180.34
N$2
  Bottom 0.254: LM324N.3 40.64,139.7 39.37,139.7 38.1,140.97 29.21,140.97 29.21,135.89 27.94,134.62 6.35,133.35 7.62,168.91 30.48,170.18 R2.P$2 C2.1
N$3
  Bottom 0.254: LM324N.2 LM324N.1 38.1,137.16 38.1,139.7 33.02,139.7 T1.B 30.48,132.08 50.8,132.08 53.34,134.62 53.34,137.16 55.88,139.7 55.88,168.91 C1.1
N$4
  Bottom 0.254: T1.E 8.89,139.7 8.89,166.37 26.67,166.37 Q2.2
N$5
  Bottom 0.254: Q1.2 43.18,166.37 Q1.1 38.1,161.29 36.83,157.48 35.56,156.21 27.94,156.21 27.94,160.02 11.43,165.1 | T2.E 45.72,148.59 44.45,147.32 33.02,147.32 27.94,153.67 10.16,151.13 11.43,165.1 | Q2.1 11.43,165.1
N$6  (1 unrouted)
N$7
  Bottom 0.61: LM324N.11 50.8,147.32 53.34,147.32 53.34,157.48 J11.1
N$8
  Bottom 0.254: T2.B 49.53,152.4 43.18,152.4 J6.1
N$9
  Bottom 0.254: J8.1 35.56,166.37 R1.P$1
N$10
  Bottom 0.254: R3.P$1 52.07,175.26 52.07,163.83
  Bottom 0.61: T1.C 36.83,133.35 50.8,133.35 50.8,139.7 53.34,142.24 53.34,144.78 54.61,146.05 T2.C 54.61,163.83 52.07,163.83 50.8,163.83 J1.1
N$11
  Bottom 0.61: C2.2 50.8,167.64 38.1,154.94 26.67,154.94 J9.1
N$12
  Bottom 0.254: Q1.3 44.45,163.83
  Bottom 0.61: Q2.3 31.75,161.29 31.75,157.48 36.83,160.02 36.83,163.83 41.91,168.91 45.72,168.91 Q1.3 | 44.45,163.83 J5.1
N$13
  Bottom 0.254: C3.2 111.76,175.26 111.76,176.53 110.49,181.61 102.87,181.61 | 102.87,181.61 85.09,181.61 R5.P$1 | R4.P$2 107.95,170.18 107.95,173.99 105.41,176.53 101.6,176.53 102.87,181.61
N$14
  Bottom 0.61: LM324N.4 41.91,140.97 39.37,140.97 29.21,148.59 J10.1
N$15
  Bottom 0.254: LM324N1.3 99.06,140.97 97.79,140.97 96.52,142.24 87.63,142.24 87.63,137.16 86.36,135.89 64.77,134.62 66.04,170.18 88.9,171.45 R5.P$2 C4.1
N$16
  Bottom 0.254: LM324N1.2 LM324N1.1 96.52,138.43 96.52,140.97 91.44,140.97 T3.B 88.9,133.35 109.22,133.35 111.76,135.89 111.76,138.43 114.3,140.97 114.3,170.18 C3.1
N$17
  Bottom 0.254: T3.E 67.31,140.97 67.31,167.64 85.09,167.64 Q4.2
N$18
  Bottom 0.254: Q3.2 101.6,167.64 Q3.1 96.52,162.56 95.25,158.75 93.98,157.48 86.36,157.48 86.36,161.29 69.85,166.37 | T4.E 104.14,149.86 102.87,148.59 91.44,148.59 86.36,154.94 68.58,152.4 69.85,166.37 | Q4.1 69.85,166.37
N$19
  Bottom 0.254: R6.P$1 110.49,176.53 110.49,165.1
  Bottom 0.61: T3.C 95.25,134.62 109.22,134.62 109.22,140.97 111.76,143.51 111.76,146.05 113.03,147.32 T4.C 113.03,165.1 110.49,165.1 109.22,165.1 J2.1
N$20
  Bottom 0.254: Q3.3 102.87,165.1
  Bottom 0.61: Q4.3 90.17,162.56 90.17,158.75 95.25,161.29 95.25,165.1 100.33,170.18 104.14,170.18 Q3.3 | 102.87,165.1 J3.1
N$21
  Bottom 0.61: LM324N1.11 109.22,148.59 111.76,148.59 111.76,158.75 J16.1
N$22
  Bottom 0.254: T4.B 107.95,153.67 101.6,153.67 J4.1
N$23
  Bottom 0.254: J13.1 93.98,167.64 R4.P$1
N$24
  Bottom 0.61: C4.2 109.22,168.91 96.52,156.21 85.09,156.21 J14.1
N$25
  Bottom 0.61: LM324N1.4 100.33,142.24 97.79,142.24 87.63,149.86 J15.1
N$26  (1 unrouted)
N$27
  Bottom 0.254: C5.2 171.45,176.53 171.45,177.8 170.18,182.88 162.56,182.88 | 162.56,182.88 144.78,182.88 R8.P$1 | R7.P$2 167.64,171.45 167.64,175.26 165.1,177.8 161.29,177.8 162.56,182.88
N$28
  Bottom 0.254: LM324N2.3 158.75,142.24 157.48,142.24 156.21,143.51 147.32,143.51 147.32,138.43 146.05,137.16 124.46,135.89 125.73,171.45 148.59,172.72 R8.P$2 C6.1
N$29
  Bottom 0.254: LM324N2.2 LM324N2.1 156.21,139.7 156.21,142.24 151.13,142.24 T5.B 148.59,134.62 168.91,134.62 171.45,137.16 171.45,139.7 173.99,142.24 173.99,171.45 C5.1
N$30
  Bottom 0.254: T5.E 127,142.24 127,168.91 144.78,168.91 Q6.2
N$31
  Bottom 0.254: Q5.2 161.29,168.91 Q5.1 156.21,163.83 154.94,160.02 153.67,158.75 146.05,158.75 146.05,162.56 129.54,167.64 | T6.E 163.83,151.13 162.56,149.86 151.13,149.86 146.05,156.21 128.27,153.67 129.54,167.64 | Q6.1 129.54,167.64
N$32
  Bottom 0.254: R9.P$1 170.18,177.8 170.18,166.37
  Bottom 0.61: T5.C 154.94,135.89 168.91,135.89 168.91,142.24 171.45,144.78 171.45,147.32 172.72,148.59 T6.C 172.72,166.37 170.18,166.37 168.91,166.37 J17.1
N$33
  Bottom 0.254: Q5.3 162.56,166.37
  Bottom 0.61: Q6.3 149.86,163.83 149.86,160.02 154.94,162.56 154.94,166.37 160.02,171.45 163.83,171.45 Q5.3 | 162.56,166.37 J18.1
N$34
  Bottom 0.61: LM324N2.11 168.91,149.86 171.45,149.86 171.45,160.02 J24.1
N$35
  Bottom 0.254: T6.B 167.64,154.94 161.29,154.94 J19.1
N$36
  Bottom 0.254: J21.1 153.67,168.91 R7.P$1
N$37
  Bottom 0.61: C6.2 168.91,170.18 156.21,157.48 144.78,157.48 J22.1
N$38
  Bottom 0.61: LM324N2.4 160.02,143.51 157.48,143.51 147.32,151.13 J23.1
N$39  (1 unrouted)
N$40
  Bottom 0.254: C7.2 232.41,176.53 232.41,177.8 231.14,182.88 223.52,182.88 | 223.52,182.88 205.74,182.88 R11.P$1 | R10.P$2 228.6,171.45 228.6,175.26 226.06,177.8 222.25,177.8 223.52,182.88
N$41
  Bottom 0.254: LM324N3.3 219.71,142.24 218.44,142.24 217.17,143.51 208.28,143.51 208.28,138.43 207.01,137.16 185.42,135.89 186.69,171.45 209.55,172.72 R11.P$2 C8.1
N$42
  Bottom 0.254: LM324N3.2 LM324N3.1 217.17,139.7 217.17,142.24 212.09,142.24 T7.B 209.55,134.62 229.87,134.62 232.41,137.16 232.41,139.7 234.95,142.24 234.95,171.45 C7.1
N$43
  Bottom 0.254: T7.E 187.96,142.24 187.96,168.91 205.74,168.91 Q8.2
N$44
  Bottom 0.254: Q7.2 222.25,168.91 Q7.1 217.17,163.83 215.9,160.02 214.63,158.75 207.01,158.75 207.01,162.56 190.5,167.64 | T8.E 224.79,151.13 223.52,149.86 212.09,149.86 207.01,156.21 189.23,153.67 190.5,167.64 | Q8.1 190.5,167.64
N$45
  Bottom 0.254: R12.P$1 231.14,177.8 231.14,166.37
  Bottom 0.61: T7.C 215.9,135.89 229.87,135.89 229.87,142.24 232.41,144.78 232.41,147.32 233.68,148.59 T8.C 233.68,166.37 231.14,166.37 229.87,166.37 J25.1
N$46
  Bottom 0.254: Q7.3 223.52,166.37
  Bottom 0.61: Q8.3 210.82,163.83 210.82,160.02 215.9,162.56 215.9,166.37 220.98,171.45 224.79,171.45 Q7.3 | 223.52,166.37 J26.1
N$47
  Bottom 0.61: LM324N3.11 229.87,149.86 232.41,149.86 232.41,160.02 J32.1
N$48
  Bottom 0.254: T8.B 228.6,154.94 222.25,154.94 J27.1
N$49
  Bottom 0.254: J29.1 214.63,168.91 R10.P$1
N$50
  Bottom 0.61: C8.2 229.87,170.18 217.17,157.48 205.74,157.48 J30.1
N$51
  Bottom 0.61: LM324N3.4 220.98,143.51 218.44,143.51 208.28,151.13 J31.1
N$52  (1 unrouted)
N$53
  Bottom 0.254: C9.2 53.34,109.22 53.34,110.49 52.07,115.57 44.45,115.57 | 44.45,115.57 26.67,115.57 R14.P$1 | R13.P$2 49.53,104.14 49.53,107.95 46.99,110.49 43.18,110.49 44.45,115.57
N$54
  Bottom 0.254: LM324N4.3 40.64,74.93 39.37,74.93 38.1,76.2 29.21,76.2 29.21,71.12 27.94,69.85 6.35,68.58 7.62,104.14 30.48,105.41 R14.P$2 C10.1
N$55
  Bottom 0.254: LM324N4.2 LM324N4.1 38.1,72.39 38.1,74.93 33.02,74.93 T9.B 30.48,67.31 50.8,67.31 53.34,69.85 53.34,72.39 55.88,74.93 55.88,104.14 C9.1
N$56
  Bottom 0.254: T9.E 8.89,74.93 8.89,101.6 26.67,101.6 Q10.2
N$57
  Bottom 0.254: Q9.2 43.18,101.6 Q9.1 38.1,96.52 36.83,92.71 35.56,91.44 27.94,91.44 27.94,95.25 11.43,100.33 | T10.E 45.72,83.82 44.45,82.55 33.02,82.55 27.94,88.9 10.16,86.36 11.43,100.33 | Q10.1 11.43,100.33
N$58
  Bottom 0.254: R15.P$1 52.07,110.49 52.07,99.06
  Bottom 0.61: T9.C 36.83,68.58 50.8,68.58 50.8,74.93 53.34,77.47 53.34,80.01 54.61,81.28 T10.C 54.61,99.06 52.07,99.06 50.8,99.06 J33.1
N$59
  Bottom 0.254: Q9.3 44.45,99.06
  Bottom 0.61: Q10.3 31.75,96.52 31.75,92.71 36.83,95.25 36.83,99.06 41.91,104.14 45.72,104.14 Q9.3 | 44.45,99.06 J34.1
N$60
  Bottom 0.61: LM324N4.11 50.8,82.55 53.34,82.55 53.34,92.71 J40.1
N$61
  Bottom 0.254: T10.B 49.53,87.63 43.18,87.63 J35.1
N$62
  Bottom 0.254: J37.1 35.56,101.6 R13.P$1
N$63
  Bottom 0.61: C10.2 50.8,102.87 38.1,90.17 26.67,90.17 J38.1
N$64
  Bottom 0.61: LM324N4.4 41.91,76.2 39.37,76.2 29.21,83.82 J39.1
N$65  (1 unrouted)
N$66
  Bottom 0.254: C11.2 113.03,109.22 113.03,110.49 111.76,115.57 104.14,115.57 | 104.14,115.57 86.36,115.57 R17.P$1 | R16.P$2 109.22,104.14 109.22,107.95 106.68,110.49 102.87,110.49 104.14,115.57
N$67
  Bottom 0.254: LM324N5.3 100.33,74.93 99.06,74.93 97.79,76.2 88.9,76.2 88.9,71.12 87.63,69.85 66.04,68.58 67.31,104.14 90.17,105.41 R17.P$2 C12.1
N$68
  Bottom 0.254: LM324N5.2 LM324N5.1 97.79,72.39 97.79,74.93 92.71,74.93 T11.B 90.17,67.31 110.49,67.31 113.03,69.85 113.03,72.39 115.57,74.93 115.57,104.14 C11.1
N$69
  Bottom 0.254: T11.E 68.58,74.93 68.58,101.6 86.36,101.6 Q12.2
N$70
  Bottom 0.254: Q11.2 102.87,101.6 Q11.1 97.79,96.52 96.52,92.71 95.25,91.44 87.63,91.44 87.63,95.25 71.12,100.33 | T12.E 105.41,83.82 104.14,82.55 92.71,82.55 87.63,88.9 69.85,86.36 71.12,100.33 | Q12.1 71.12,100.33
N$71
  Bottom 0.254: R18.P$1 111.76,110.49 111.76,99.06
  Bottom 0.61: T11.C 96.52,68.58 110.49,68.58 110.49,74.93 113.03,77.47 113.03,80.01 114.3,81.28 T12.C 114.3,99.06 111.76,99.06 110.49,99.06 J41.1
N$72
  Bottom 0.254: Q11.3 104.14,99.06
  Bottom 0.61: Q12.3 91.44,96.52 91.44,92.71 96.52,95.25 96.52,99.06 101.6,104.14 105.41,104.14 Q11.3 | 104.14,99.06 J42.1
N$73
  Bottom 0.61: LM324N5.11 110.49,82.55 113.03,82.55 113.03,92.71 J48.1
N$74
  Bottom 0.254: T12.B 109.22,87.63 102.87,87.63 J43.1
N$75
  Bottom 0.254: J45.1 95.25,101.6 R16.P$1
N$76
  Bottom 0.61: C12.2 110.49,102.87 97.79,90.17 86.36,90.17 J46.1
N$77
  Bottom 0.61: LM324N5.4 101.6,76.2 99.06,76.2 88.9,83.82 J47.1
N$78  (1 unrouted)
N$79
  Bottom 0.254: C13.2 172.72,109.22 172.72,110.49 171.45,115.57 163.83,115.57 | 163.83,115.57 146.05,115.57 R20.P$1 | R19.P$2 168.91,104.14 168.91,107.95 166.37,110.49 162.56,110.49 163.83,115.57
N$80
  Bottom 0.254: LM324N6.3 160.02,74.93 158.75,74.93 157.48,76.2 148.59,76.2 148.59,71.12 147.32,69.85 125.73,68.58 127,104.14 149.86,105.41 R20.P$2 C14.1
N$81
  Bottom 0.254: LM324N6.2 LM324N6.1 157.48,72.39 157.48,74.93 152.4,74.93 T13.B 149.86,67.31 170.18,67.31 172.72,69.85 172.72,72.39 175.26,74.93 175.26,104.14 C13.1
N$82
  Bottom 0.254: T13.E 128.27,74.93 128.27,101.6 146.05,101.6 Q14.2
N$83
  Bottom 0.254: Q13.2 162.56,101.6 Q13.1 157.48,96.52 156.21,92.71 154.94,91.44 147.32,91.44 147.32,95.25 130.81,100.33 | T14.E 165.1,83.82 163.83,82.55 152.4,82.55 147.32,88.9 129.54,86.36 130.81,100.33 | Q14.1 130.81,100.33
N$84
  Bottom 0.254: R21.P$1 171.45,110.49 171.45,99.06
  Bottom 0.61: T13.C 156.21,68.58 170.18,68.58 170.18,74.93 172.72,77.47 172.72,80.01 173.99,81.28 T14.C 173.99,99.06 171.45,99.06 170.18,99.06 J49.1
N$85
  Bottom 0.254: Q13.3 163.83,99.06
  Bottom 0.61: Q14.3 151.13,96.52 151.13,92.71 156.21,95.25 156.21,99.06 161.29,104.14 165.1,104.14 Q13.3 | 163.83,99.06 J50.1
N$86
  Bottom 0.61: LM324N6.11 170.18,82.55 172.72,82.55 172.72,92.71 J56.1
N$87
  Bottom 0.254: T14.B 168.91,87.63 162.56,87.63 J51.1
N$88
  Bottom 0.254: J53.1 154.94,101.6 R19.P$1
N$89
  Bottom 0.61: C14.2 170.18,102.87 157.48,90.17 146.05,90.17 J54.1
N$90
  Bottom 0.61: LM324N6.4 161.29,76.2 158.75,76.2 148.59,83.82 J55.1
N$91  (1 unrouted)
N$92
  Bottom 0.254: C15.2 231.14,110.49 231.14,111.76 229.87,116.84 222.25,116.84 | 222.25,116.84 204.47,116.84 R23.P$1 | R22.P$2 227.33,105.41 227.33,109.22 224.79,111.76 220.98,111.76 222.25,116.84
N$93
  Bottom 0.254: LM324N7.3 218.44,76.2 217.17,76.2 215.9,77.47 207.01,77.47 207.01,72.39 205.74,71.12 184.15,69.85 185.42,105.41 208.28,106.68 R23.P$2 C16.1
N$94
  Bottom 0.254: LM324N7.2 LM324N7.1 215.9,73.66 215.9,76.2 210.82,76.2 T15.B 208.28,68.58 228.6,68.58 231.14,71.12 231.14,73.66 233.68,76.2 233.68,105.41 C15.1
N$95
  Bottom 0.254: T15.E 186.69,76.2 186.69,102.87 204.47,102.87 Q16.2
N$96
  Bottom 0.254: Q15.2 220.98,102.87 Q15.1 215.9,97.79 214.63,93.98 213.36,92.71 205.74,92.71 205.74,96.52 189.23,101.6 | T16.E 223.52,85.09 222.25,83.82 210.82,83.82 205.74,90.17 187.96,87.63 189.23,101.6 | Q16.1 189.23,101.6
N$97
  Bottom 0.254: R24.P$1 229.87,111.76 229.87,100.33
  Bottom 0.61: T15.C 214.63,69.85 228.6,69.85 228.6,76.2 231.14,78.74 231.14,81.28 232.41,82.55 T16.C 232.41,100.33 229.87,100.33 228.6,100.33 J57.1
N$98
  Bottom 0.254: Q15.3 222.25,100.33
  Bottom 0.61: Q16.3 209.55,97.79 209.55,93.98 214.63,96.52 214.63,100.33 219.71,105.41 223.52,105.41 Q15.3 | 222.25,100.33 J58.1
N$99
  Bottom 0.61: LM324N7.11 228.6,83.82 231.14,83.82 231.14,93.98 J64.1
N$100
  Bottom 0.254: T16.B 227.33,88.9 220.98,88.9 J59.1
N$101
  Bottom 0.254: J61.1 213.36,102.87 R22.P$1
N$102
  Bottom 0.61: C16.2 228.6,104.14 215.9,91.44 204.47,91.44 J62.1
N$103
  Bottom 0.61: LM324N7.4 219.71,77.47 217.17,77.47 207.01,85.09 J63.1
N$104  (1 unrouted)
N$105
  Bottom 0.254: C17.2 52.07,49.53 52.07,50.8 50.8,55.88 43.18,55.88 | 43.18,55.88 25.4,55.88 R26.P$1 | R25.P$2 48.26,44.45 48.26,48.26 45.72,50.8 41.91,50.8 43.18,55.88
N$106
  Bottom 0.254: LM324N8.3 39.37,15.24 38.1,15.24 36.83,16.51 27.94,16.51 27.94,11.43 26.67,10.16 5.08,8.89 6.35,44.45 29.21,45.72 R26.P$2 C18.1
N$107
  Bottom 0.254: LM324N8.2 LM324N8.1 36.83,12.7 36.83,15.24 31.75,15.24 T17.B 29.21,7.62 49.53,7.62 52.07,10.16 52.07,12.7 54.61,15.24 54.61,44.45 C17.1
N$108
  Bottom 0.254: T17.E 7.62,15.24 7.62,41.91 25.4,41.91 Q18.2
N$109
  Bottom 0.254: Q17.2 41.91,41.91 Q17.1 36.83,36.83 35.56,33.02 34.29,31.75 26.67,31.75 26.67,35.56 10.16,40.64 | T18.E 44.45,24.13 43.18,22.86 31.75,22.86 26.67,29.21 8.89,26.67 10.16,40.64 | Q18.1 10.16,40.64
N$110
  Bottom 0.254: R27.P$1 50.8,50.8 50.8,39.37
  Bottom 0.61: T17.C 35.56,8.89 49.53,8.89 49.53,15.24 52.07,17.78 52.07,20.32 53.34,21.59 T18.C 53.34,39.37 50.8,39.37 49.53,39.37 J65.1
N$111
  Bottom 0.254: Q17.3 43.18,39.37
  Bottom 0.61: Q18.3 30.48,36.83 30.48,33.02 35.56,35.56 35.56,39.37 40.64,44.45 44.45,44.45 Q17.3 | 43.18,39.37 J66.1
N$112
  Bottom 0.61: LM324N8.11 49.53,22.86 52.07,22.86 52.07,33.02 J72.1
N$113
  Bottom 0.254: T18.B 48.26,27.94 41.91,27.94 J67.1
N$114
  Bottom 0.254: J69.1 34.29,41.91 R25.P$1
N$115
  Bottom 0.61: C18.2 49.53,43.18 36.83,30.48 25.4,30.48 J70.1
N$116
  Bottom 0.61: LM324N8.4 40.64,16.51 38.1,16.51 27.94,24.13 J71.1
N$117  (1 unrouted)
N$118
  Bottom 0.254: C19.2 113.03,49.53 113.03,50.8 111.76,55.88 104.14,55.88 | 104.14,55.88 86.36,55.88 R29.P$1 | R28.P$2 109.22,44.45 109.22,48.26 106.68,50.8 102.87,50.8 104.14,55.88
N$119
  Bottom 0.254: LM324N9.3 100.33,15.24 99.06,15.24 97.79,16.51 88.9,16.51 88.9,11.43 87.63,10.16 66.04,8.89 67.31,44.45 90.17,45.72 R29.P$2 C20.1
N$120
  Bottom 0.254: LM324N9.2 LM324N9.1 97.79,12.7 97.79,15.24 92.71,15.24 T19.B 90.17,7.62 110.49,7.62 113.03,10.16 113.03,12.7 115.57,15.24 115.57,44.45 C19.1
N$121
  Bottom 0.254: T19.E 68.58,15.24 68.58,41.91 86.36,41.91 Q20.2
N$122
  Bottom 0.254: Q19.2 102.87,41.91 Q19.1 97.79,36.83 96.52,33.02 95.25,31.75 87.63,31.75 87.63,35.56 71.12,40.64 | T20.E 105.41,24.13 104.14,22.86 92.71,22.86 87.63,29.21 69.85,26.67 71.12,40.64 | Q20.1 71.12,40.64
N$123
  Bottom 0.254: R30.P$1 111.76,50.8 111.76,39.37
  Bottom 0.61: T19.C 96.52,8.89 110.49,8.89 110.49,15.24 113.03,17.78 113.03,20.32 114.3,21.59 T20.C 114.3,39.37 111.76,39.37 110.49,39.37 J73.1
N$124
  Bottom 0.254: Q19.3 104.14,39.37
  Bottom 0.61: Q20.3 91.44,36.83 91.44,33.02 96.52,35.56 96.52,39.37 101.6,44.45 105.41,44.45 Q19.3 | 104.14,39.37 J74.1
N$125
  Bottom 0.61: LM324N9.11 110.49,22.86 113.03,22.86 113.03,33.02 J80.1
N$126
  Bottom 0.254: T20.B 109.22,27.94 102.87,27.94 J75.1
N$127
  Bottom 0.254: J77.1 95.25,41.91 R28.P$1
N$128
  Bottom 0.61: C20.2 110.49,43.18 97.79,30.48 86.36,30.48 J78.1
N$129
  Bottom 0.61: LM324N9.4 101.6,16.51 99.06,16.51 88.9,24.13 J79.1
N$130  (1 unrouted)
N$131
  Bottom 0.254: C21.2 172.72,50.8 172.72,52.07 171.45,57.15 163.83,57.15 | 163.83,57.15 146.05,57.15 R32.P$1 | R31.P$2 168.91,45.72 168.91,49.53 166.37,52.07 162.56,52.07 163.83,57.15
N$132
  Bottom 0.254: LM324N10.3 160.02,16.51 158.75,16.51 157.48,17.78 148.59,17.78 148.59,12.7 147.32,11.43 125.73,10.16 127,45.72 149.86,46.99 R32.P$2 C22.1
N$133
  Bottom 0.254: LM324N10.2 LM324N10.1 157.48,13.97 157.48,16.51 152.4,16.51 T21.B 149.86,8.89 170.18,8.89 172.72,11.43 172.72,13.97 175.26,16.51 175.26,45.72 C21.1
N$134
  Bottom 0.254: T21.E 128.27,16.51 128.27,43.18 146.05,43.18 Q22.2
N$135
  Bottom 0.254: Q21.2 162.56,43.18 Q21.1 157.48,38.1 156.21,34.29 154.94,33.02 147.32,33.02 147.32,36.83 130.81,41.91 | T22.E 165.1,25.4 163.83,24.13 152.4,24.13 147.32,30.48 129.54,27.94 130.81,41.91 | Q22.1 130.81,41.91
N$136
  Bottom 0.254: R33.P$1 171.45,52.07 171.45,40.64
  Bottom 0.61: T21.C 156.21,10.16 170.18,10.16 170.18,16.51 172.72,19.05 172.72,21.59 173.99,22.86 T22.C 173.99,40.64 171.45,40.64 170.18,40.64 J81.1
N$137
  Bottom 0.254: Q21.3 163.83,40.64
  Bottom 0.61: Q22.3 151.13,38.1 151.13,34.29 156.21,36.83 156.21,40.64 161.29,45.72 165.1,45.72 Q21.3 | 163.83,40.64 J82.1
N$138
  Bottom 0.61: LM324N10.11 170.18,24.13 172.72,24.13 172.72,34.29 J88.1
N$139
  Bottom 0.254: T22.B 168.91,29.21 162.56,29.21 J83.1
N$140
  Bottom 0.254: J85.1 154.94,43.18 R31.P$1
N$141
  Bottom 0.61: C22.2 170.18,44.45 157.48,31.75 146.05,31.75 J86.1
N$142
  Bottom 0.61: LM324N10.4 161.29,17.78 158.75,17.78 148.59,25.4 J87.1
N$143  (1 unrouted)
N$144
  Bottom 0.254: C23.2 232.41,52.07 232.41,53.34 231.14,58.42 223.52,58.42 | 223.52,58.42 205.74,58.42 R35.P$1 | R34.P$2 228.6,46.99 228.6,50.8 226.06,53.34 222.25,53.34 223.52,58.42
N$145
  Bottom 0.254: LM324N11.3 219.71,17.78 218.44,17.78 217.17,19.05 208.28,19.05 208.28,13.97 207.01,12.7 185.42,11.43 186.69,46.99 209.55,48.26 R35.P$2 C24.1
N$146
  Bottom 0.254: LM324N11.2 LM324N11.1 217.17,15.24 217.17,17.78 212.09,17.78 T23.B 209.55,10.16 229.87,10.16 232.41,12.7 232.41,15.24 234.95,17.78 234.95,46.99 C23.1
N$147
  Bottom 0.254: T23.E 187.96,17.78 187.96,44.45 205.74,44.45 Q24.2
N$148
  Bottom 0.254: Q23.2 222.25,44.45 Q23.1 217.17,39.37 215.9,35.56 214.63,34.29 207.01,34.29 207.01,38.1 190.5,43.18 | T24.E 224.79,26.67 223.52,25.4 212.09,25.4 207.01,31.75 189.23,29.21 190.5,43.18 | Q24.1 190.5,43.18
N$149
  Bottom 0.254: R36.P$1 231.14,53.34 231.14,41.91
  Bottom 0.61: T23.C 215.9,11.43 229.87,11.43 229.87,17.78 232.41,20.32 232.41,22.86 233.68,24.13 T24.C 233.68,41.91 231.14,41.91 229.87,41.91 J89.1
N$150
  Bottom 0.254: Q23.3 223.52,41.91
  Bottom 0.61: Q24.3 210.82,39.37 210.82,35.56 215.9,38.1 215.9,41.91 220.98,46.99 224.79,46.99 Q23.3 | 223.52,41.91 J90.1
N$151
  Bottom 0.61: LM324N11.11 229.87,25.4 232.41,25.4 232.41,35.56 J96.1
N$152
  Bottom 0.254: T24.B 228.6,30.48 222.25,30.48 J91.1
N$153
  Bottom 0.254: J93.1 214.63,44.45 R34.P$1
N$154
  Bottom 0.61: C24.2 229.87,45.72 217.17,33.02 205.74,33.02 J94.1
N$155
  Bottom 0.61: LM324N11.4 220.98,19.05 218.44,19.05 208.28,26.67 J95.1
N$156  (1 unrouted)